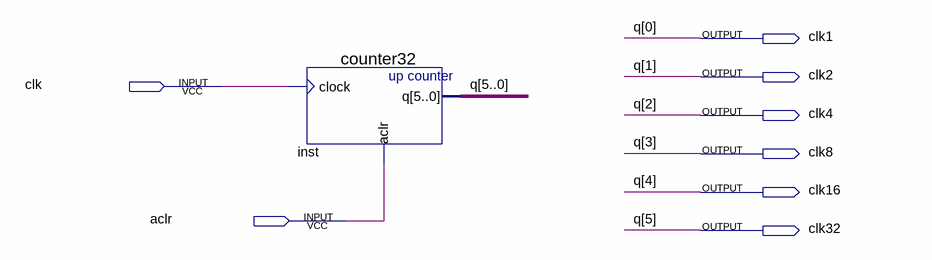
[diagram p0: schematic sheet]
// Quartus schematic clk_gen.bdf as structural Verilog: 1 symbols, 8 pins
module clk_gen (
  input  clk,
  input  aclr,
  output clk1,
  output clk2,
  output clk4,
  output clk8,
  output clk16,
  output clk32
);

  counter32 inst (.clock(clk), .aclr(aclr), .q({clk32, clk16, clk8, clk4, clk2, clk1}));

  // Other names for the same wires on the sheet: q[5:0] = {clk32, clk16, clk8, clk4, clk2, clk1}
endmodule
